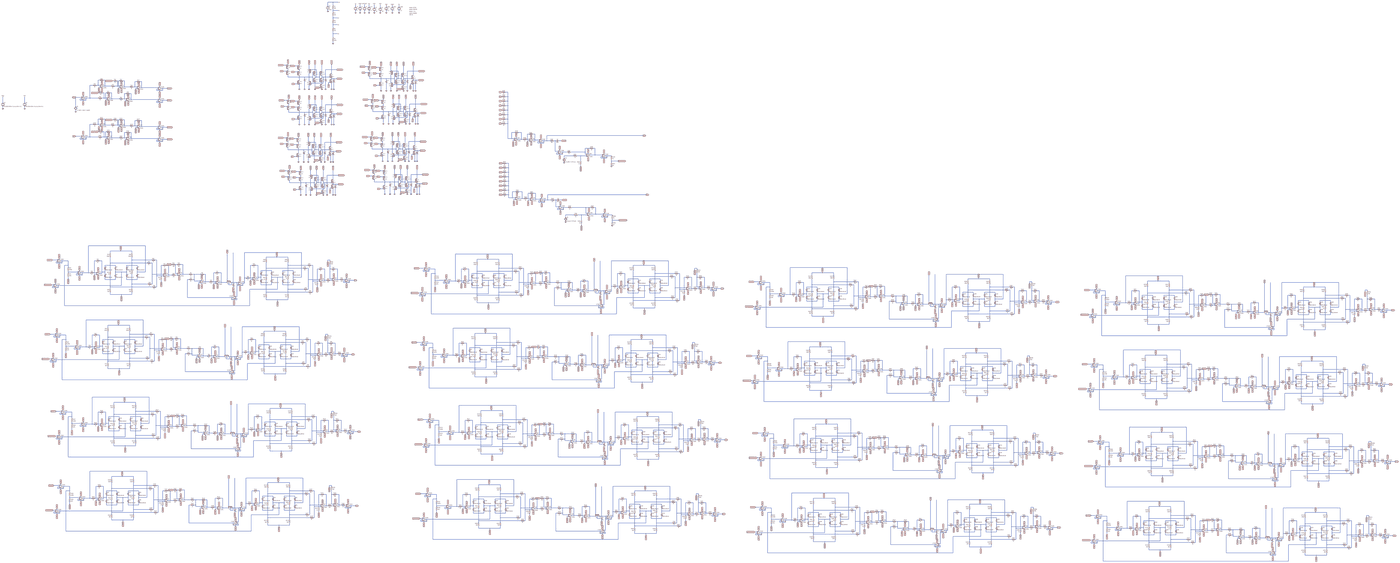
[diagram p0: schematic OZ_8_bounded_curves.asc, whole sheet]
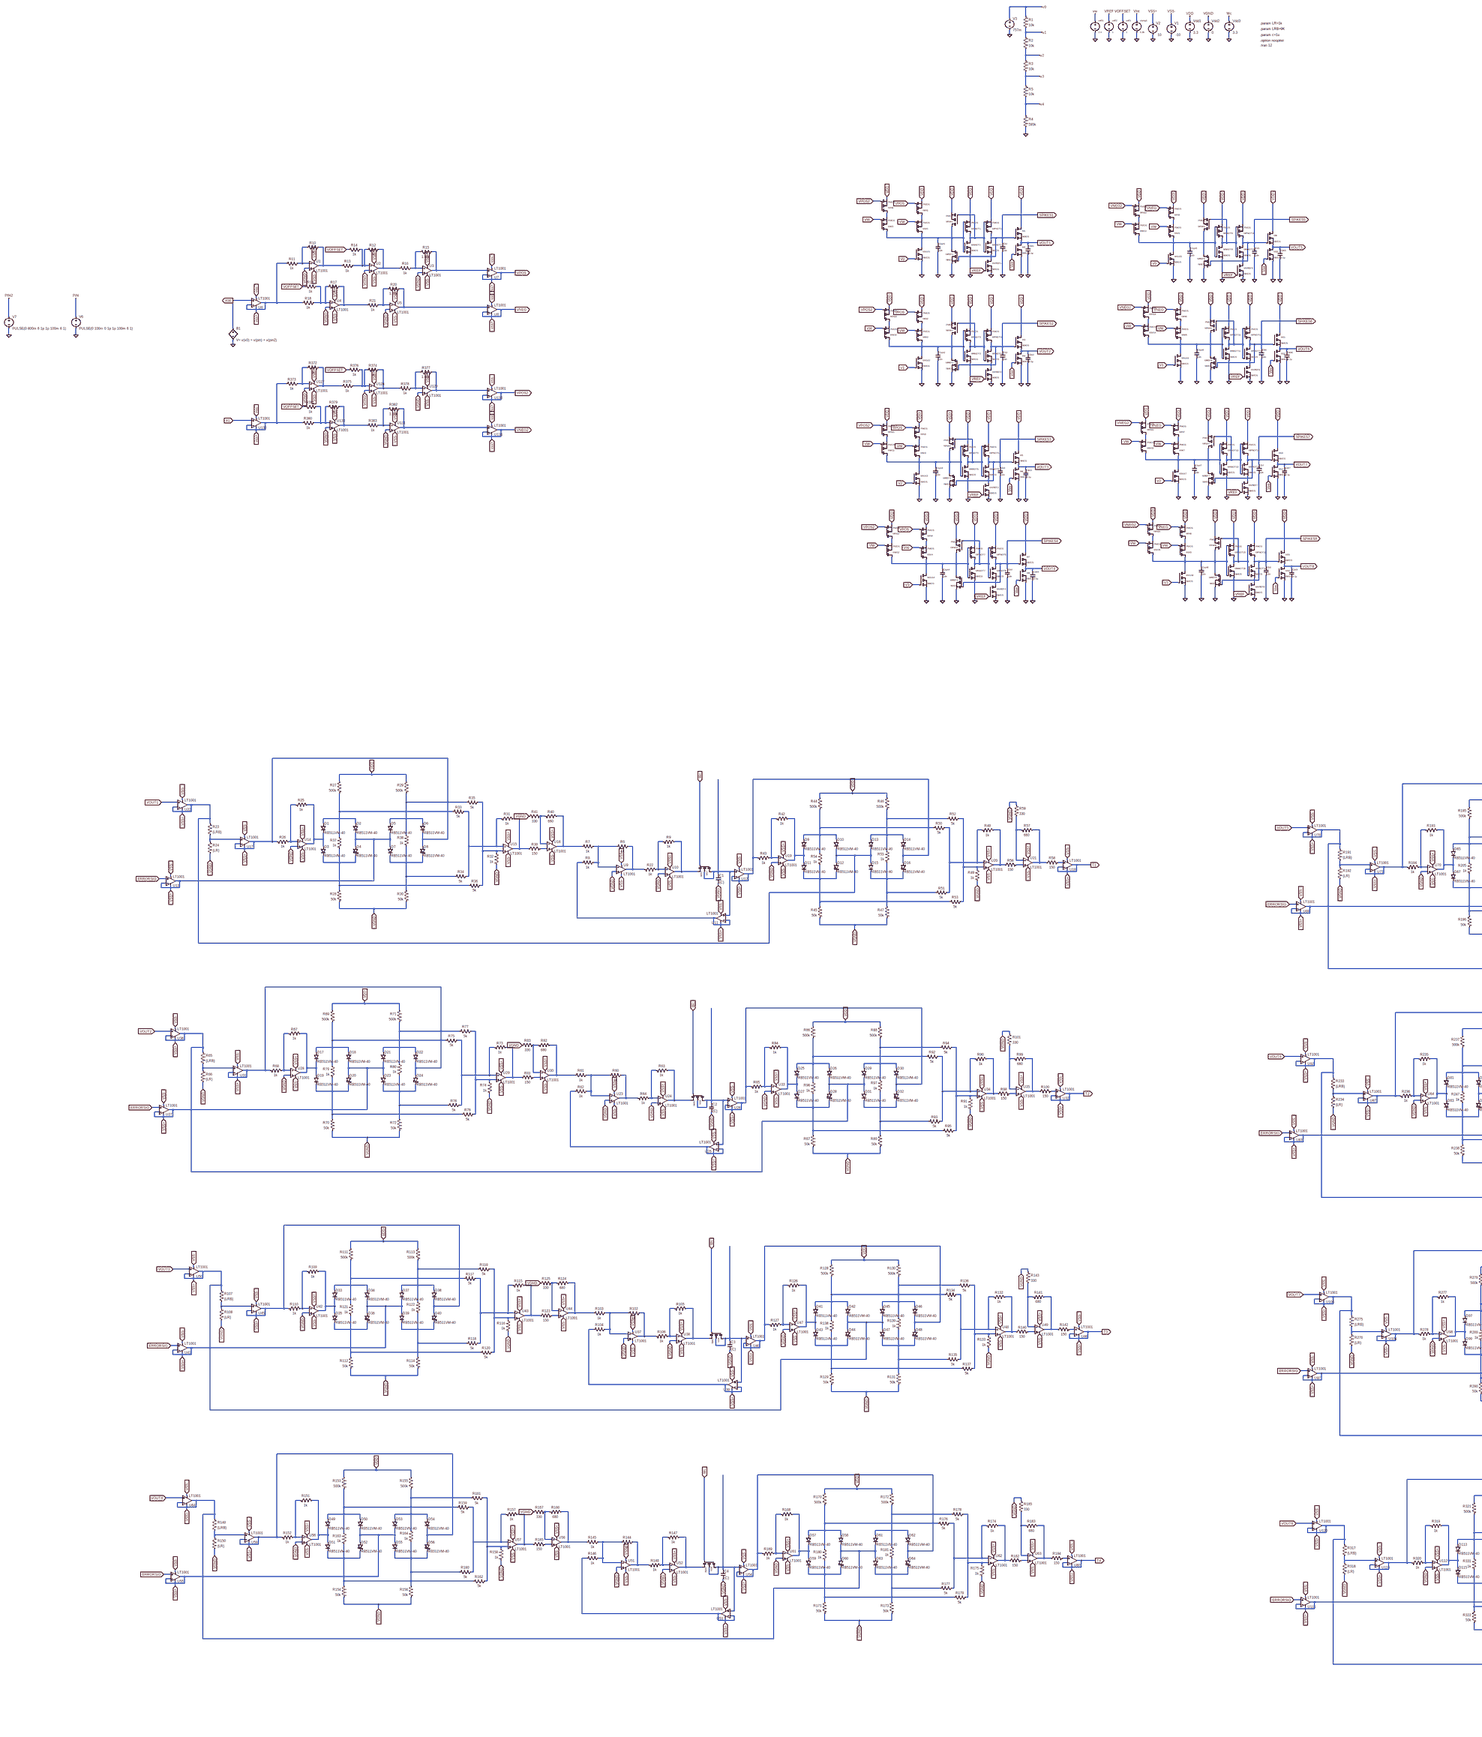
[diagram p1: schematic OZ_8_bounded_curves.asc, part, row 1 of 1, column 1 of 3]
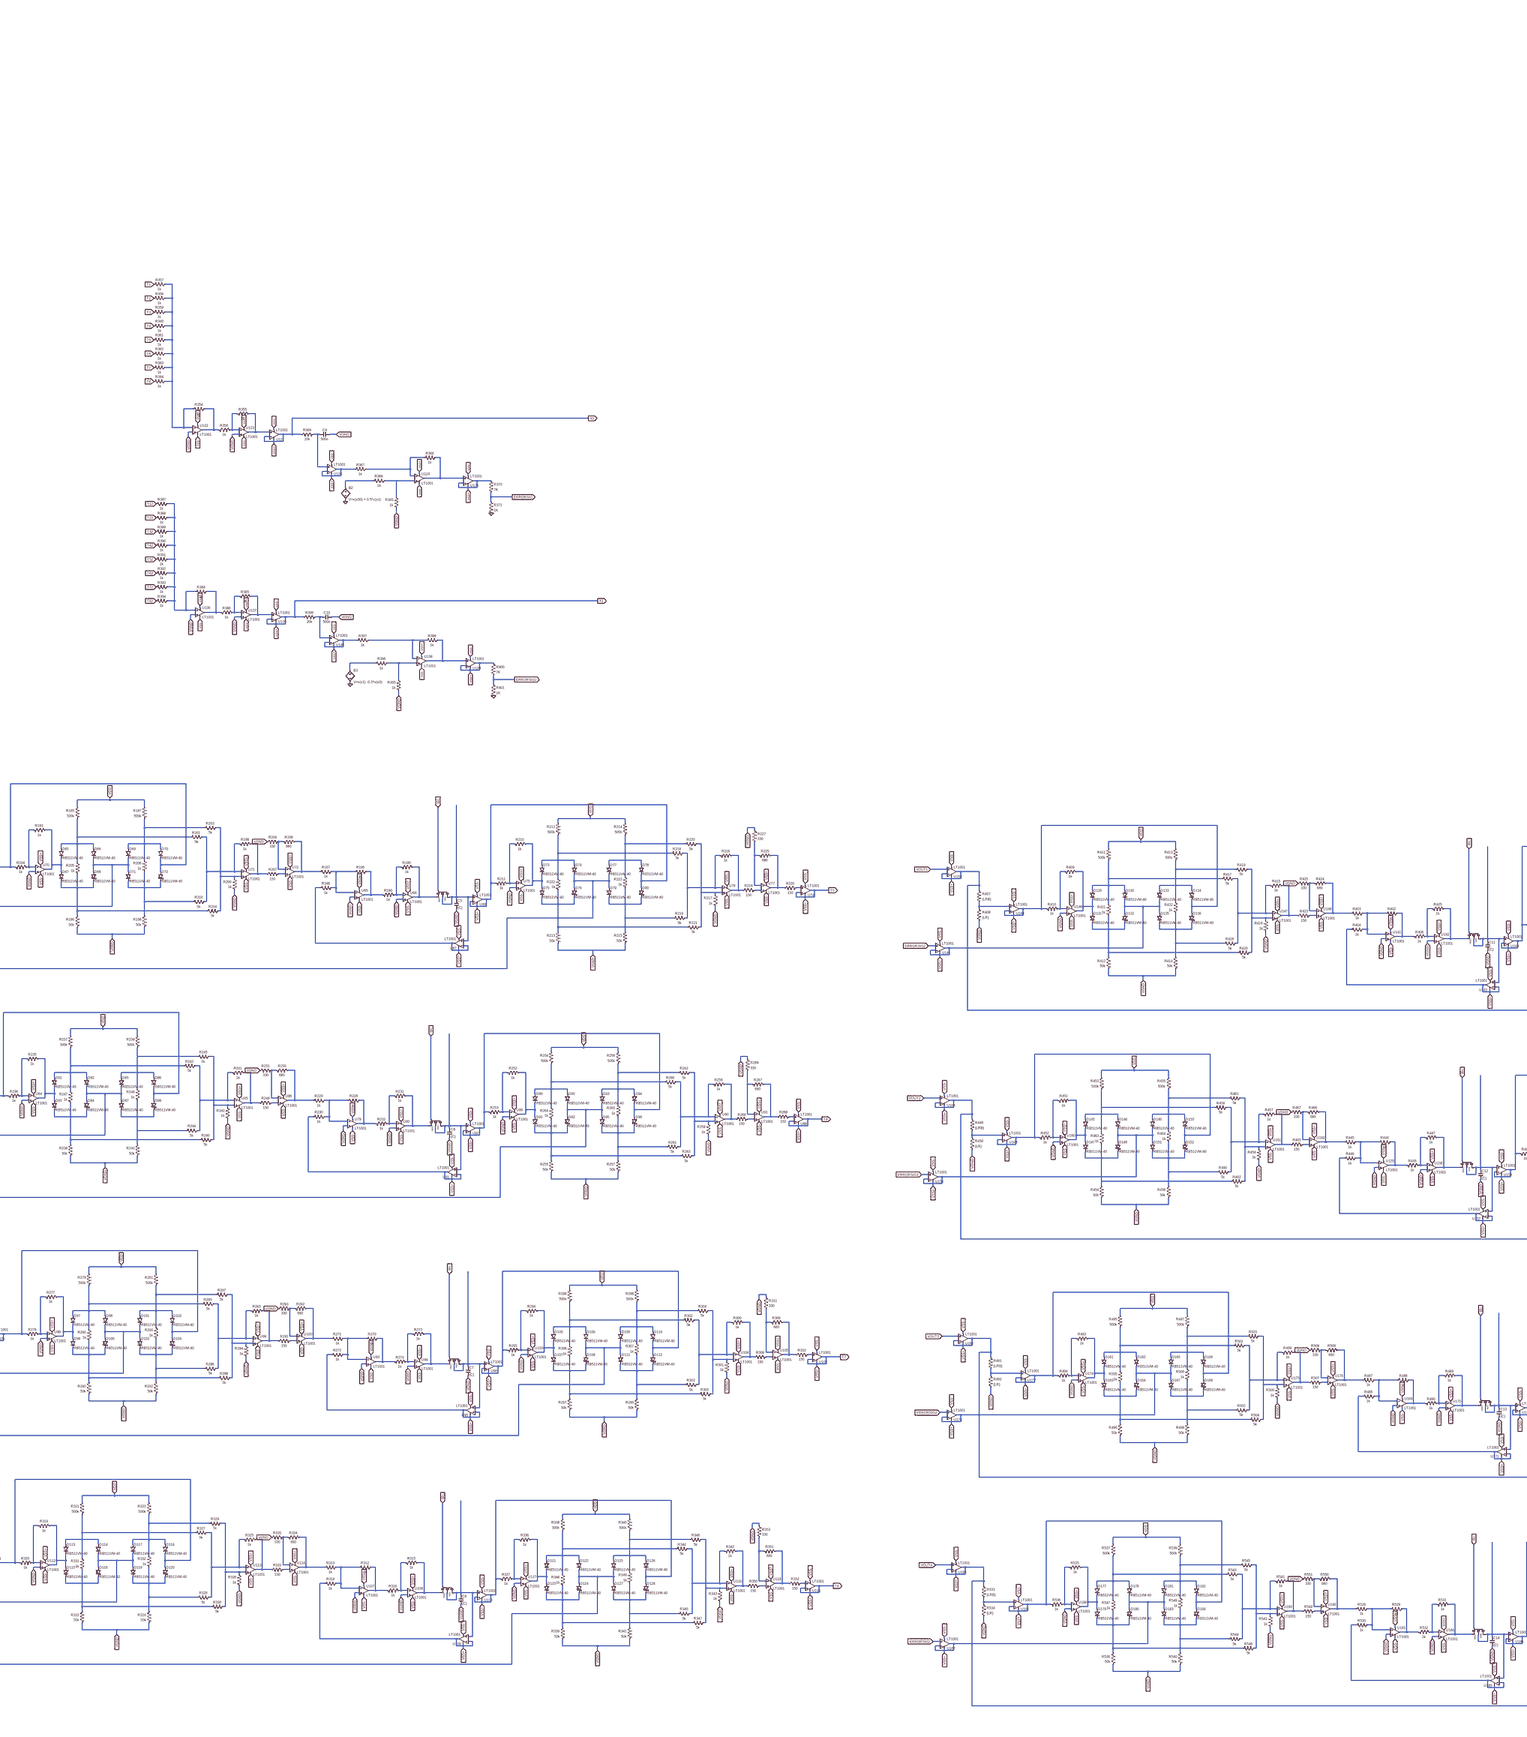
[diagram p2: schematic OZ_8_bounded_curves.asc, part, row 1 of 1, column 2 of 3]
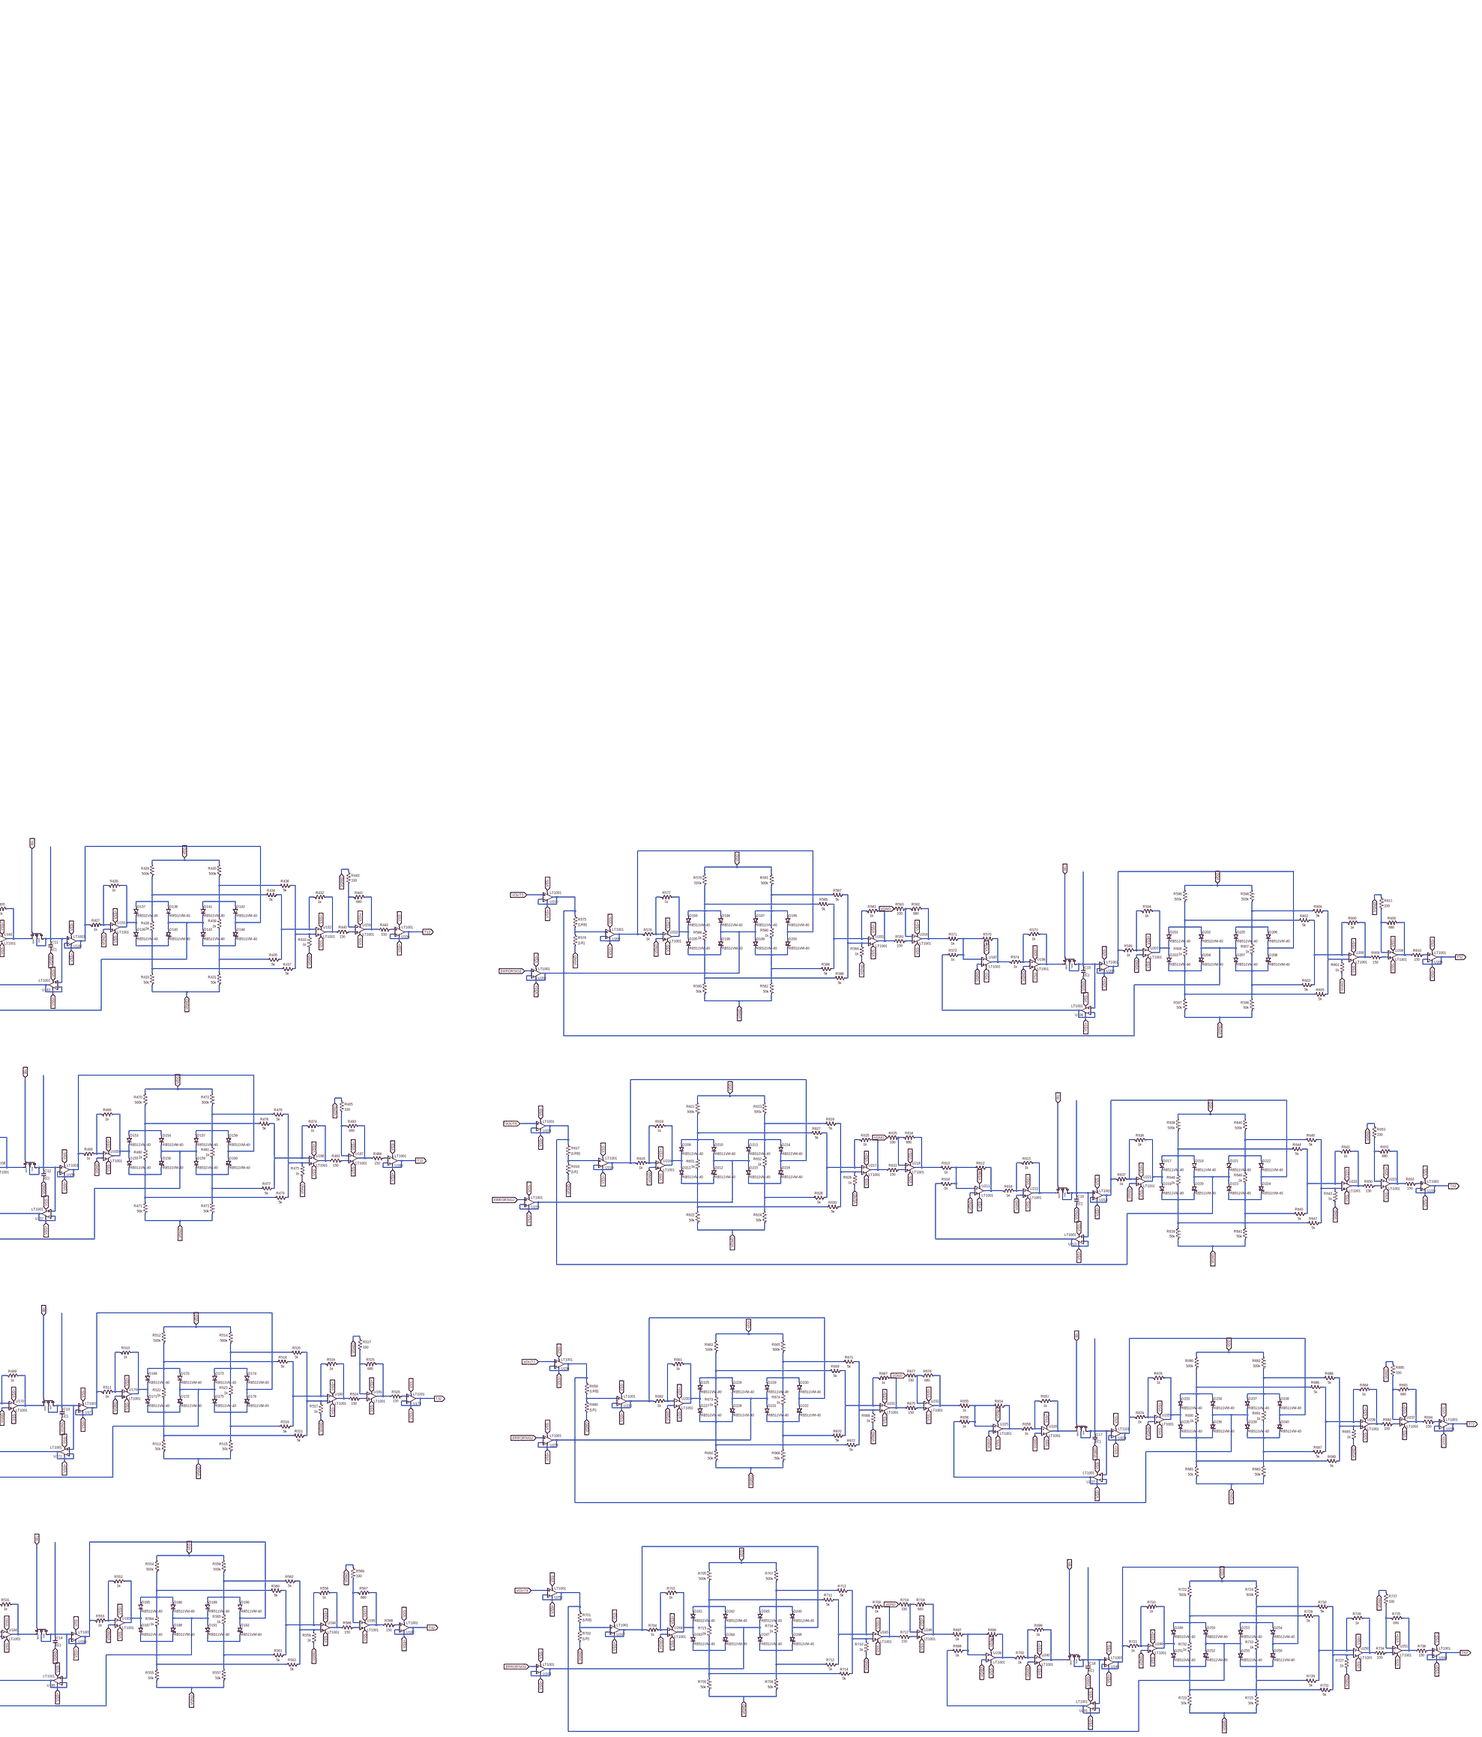
[diagram p3: schematic OZ_8_bounded_curves.asc, part, row 1 of 1, column 3 of 3]
* OZ_8_bounded_curves.asc
vtemp1 Vint 0 0.28
Vdd1 VDD 0 3.3
V1 VSS- 0 -10
V2 VSS+ 0 10
voff1 VOFFSET 0 1
voff2 VREF 0 1
voff3 vw 0 2.4
Vdd2 VGND 0 0
XU1 VGND N009 VSS+ VSS- N010 LT1001  ; pins In+ In- V+ V- OUT
R10 N010 N009 1k
R11 N009 N016 1k
XU2 VGND N011 VSS+ VSS- N012 LT1001  ; pins In+ In- V+ V- OUT
R12 N012 N011 1k
R13 N011 N010 1k
R14 N011 VOFFSET 1k
XU3 VGND N013 VSS+ VSS- N014 LT1001  ; pins In+ In- V+ V- OUT
R15 N014 N013 1.65k
R16 N013 N012 1k
XU4 VGND N019 VSS+ VSS- N020 LT1001  ; pins In+ In- V+ V- OUT
R17 N020 N019 1k
R18 N019 N016 1k
R19 N019 VOFFSET 1k
XU5 VGND N021 VSS+ VSS- N022 LT1001  ; pins In+ In- V+ V- OUT
R20 N022 N021 1.65k
R21 N021 N020 1k
XU6 X00 N016 VSS+ VSS- N016 LT1001  ; pins In+ In- V+ V- OUT
XU7 N014 VPOS VSS+ VSS- VPOS LT1001  ; pins In+ In- V+ V- OUT
XU8 N022 VNEG VSS+ VSS- VNEG LT1001  ; pins In+ In- V+ V- OUT
V3 v0 0 757m
R1 v0 v1 10k
R2 v1 v2 10k
R3 v2 v3 10k
R4 v4 0 595k
R5 v3 v4 10k
XU121 N046 X0 VSS+ VSS- X0 LT1001  ; pins In+ In- V+ V- OUT
XU122 VGND N018 VSS+ VSS- N044 LT1001  ; pins In+ In- V+ V- OUT
R354 N044 N018 1k
XU123 VGND N045 VSS+ VSS- N046 LT1001  ; pins In+ In- V+ V- OUT
R355 N045 N046 1k
R356 N044 N045 1k
R357 N018 T1 1k
R358 N018 T2 1k
R359 N018 T3 1k
R360 N018 T4 1k
R361 N018 T5 1k
R362 N018 T6 1k
R363 N018 T7 1k
R364 N018 T8 1k
M17 N148 Wc N119 N148 NMOS
C1 N148 VGND {C} IC=0
XU9 VGND N127 VSS+ VSS- N128 LT1001  ; pins In+ In- V+ V- OUT
R6 N128 N127 1k
R7 N127 N097 1k
R8 N127 N139 1k
XU10 VGND N118 VSS+ VSS- N119 LT1001  ; pins In+ In- V+ V- OUT
R9 N118 N119 1k
R22 N128 N118 1k
XU11 N148 N139 VSS+ VSS- N139 LT1001  ; pins In+ In- V+ V- OUT
XU12 N148 N086 VSS+ VSS- N086 LT1001  ; pins In+ In- V+ V- OUT
R23 N090 N116 {LRB}
R24 N116 VGND {LR}
XU13 ERRORSIG N117 VSS+ VSS- N117 LT1001  ; pins In+ In- V+ V- OUT
D1 N094 N092 RB511VM-40
XU14 VGND N091 VSS+ VSS- N092 LT1001  ; pins In+ In- V+ V- OUT
R25 N091 N092 1k
R26 N085 N091 1k
D2 N094 N117 RB511VM-40
D3 N092 N137 RB511VM-40
D4 N117 N137 RB511VM-40
R27 VDD N094 500k
R28 N137 VGND 50k
D5 N088 N117 RB511VM-40
D6 N088 N085 RB511VM-40
D7 N117 N138 RB511VM-40
D8 N085 N138 RB511VM-40
R29 VDD N088 500k
R30 N138 VGND 50k
XU15 N089 N095 VSS+ VSS- N098 LT1001  ; pins In+ In- V+ V- OUT
R31 N095 N098 1k
R32 VGND N089 1k
R33 N095 N094 5k
R34 N095 N138 5k
R35 N089 N088 5k
R36 N089 N137 5k
R37 N137 N094 1k
R38 N138 N088 1k
R39 N098 N130 150
XU16 N130 N096 VSS+ VSS- N097 LT1001  ; pins In+ In- V+ V- OUT
R40 N096 N097 680
R41 VGND N096 330
XU17 N116 N085 VSS+ VSS- N085 LT1001  ; pins In+ In- V+ V- OUT
XU18 N140 T1 VSS+ VSS- T1 LT1001  ; pins In+ In- V+ V- OUT
D9 N104 N100 RB511VM-40
XU19 VGND N099 VSS+ VSS- N100 LT1001  ; pins In+ In- V+ V- OUT
R42 N099 N100 1k
R43 N086 N099 1k
D10 N104 N090 RB511VM-40
D11 N100 N156 RB511VM-40
D12 N090 N156 RB511VM-40
R44 VDD N104 500k
R45 N156 VGND 50k
D13 N101 N090 RB511VM-40
D14 N101 N086 RB511VM-40
D15 N090 N157 RB511VM-40
D16 N086 N157 RB511VM-40
R46 VDD N101 500k
R47 N157 VGND 50k
XU20 N102 N105 VSS+ VSS- N108 LT1001  ; pins In+ In- V+ V- OUT
R48 N105 N108 1k
R49 VGND N102 1k
R50 N105 N104 5k
R51 N105 N157 5k
R52 N102 N101 5k
R53 N102 N156 5k
R54 N156 N104 1k
R55 N157 N101 1k
R56 N108 N141 150
XU21 N141 N109 VSS+ VSS- N110 LT1001  ; pins In+ In- V+ V- OUT
R57 N109 N110 680
R58 N110 N140 150
R59 VGND N109 330
XU22 VOUT1 N090 VSS+ VSS- N090 LT1001  ; pins In+ In- V+ V- OUT
M18 N292 Wc N263 N292 NMOS
C2 N292 VGND {C} IC=0
XU23 VGND N271 VSS+ VSS- N272 LT1001  ; pins In+ In- V+ V- OUT
R60 N272 N271 1k
R61 N271 N241 1k
R62 N271 N283 1k
XU24 VGND N262 VSS+ VSS- N263 LT1001  ; pins In+ In- V+ V- OUT
R63 N262 N263 1k
R64 N272 N262 1k
XU25 N292 N283 VSS+ VSS- N283 LT1001  ; pins In+ In- V+ V- OUT
XU26 N292 N230 VSS+ VSS- N230 LT1001  ; pins In+ In- V+ V- OUT
R65 N234 N260 {LRB}
R66 N260 VGND {LR}
XU27 ERRORSIG N261 VSS+ VSS- N261 LT1001  ; pins In+ In- V+ V- OUT
D17 N238 N236 RB511VM-40
XU28 VGND N235 VSS+ VSS- N236 LT1001  ; pins In+ In- V+ V- OUT
R67 N235 N236 1k
R68 N229 N235 1k
D18 N238 N261 RB511VM-40
D19 N236 N281 RB511VM-40
D20 N261 N281 RB511VM-40
R69 VDD N238 500k
R70 N281 VGND 50k
D21 N232 N261 RB511VM-40
D22 N232 N229 RB511VM-40
D23 N261 N282 RB511VM-40
D24 N229 N282 RB511VM-40
R71 VDD N232 500k
R72 N282 VGND 50k
XU29 N233 N239 VSS+ VSS- N242 LT1001  ; pins In+ In- V+ V- OUT
R73 N239 N242 1k
R74 VGND N233 1k
R75 N239 N238 5k
R76 N239 N282 5k
R77 N233 N232 5k
R78 N233 N281 5k
R79 N281 N238 1k
R80 N282 N232 1k
R81 N242 N274 150
XU30 N274 N240 VSS+ VSS- N241 LT1001  ; pins In+ In- V+ V- OUT
R82 N240 N241 680
R83 VGND N240 330
XU31 N260 N229 VSS+ VSS- N229 LT1001  ; pins In+ In- V+ V- OUT
XU32 N284 T2 VSS+ VSS- T2 LT1001  ; pins In+ In- V+ V- OUT
D25 N248 N244 RB511VM-40
XU33 VGND N243 VSS+ VSS- N244 LT1001  ; pins In+ In- V+ V- OUT
R84 N243 N244 1k
R85 N230 N243 1k
D26 N248 N234 RB511VM-40
D27 N244 N300 RB511VM-40
D28 N234 N300 RB511VM-40
R86 VDD N248 500k
R87 N300 VGND 50k
D29 N245 N234 RB511VM-40
D30 N245 N230 RB511VM-40
D31 N234 N301 RB511VM-40
D32 N230 N301 RB511VM-40
R88 VDD N245 500k
R89 N301 VGND 50k
XU34 N246 N249 VSS+ VSS- N252 LT1001  ; pins In+ In- V+ V- OUT
R90 N249 N252 1k
R91 VGND N246 1k
R92 N249 N248 5k
R93 N249 N301 5k
R94 N246 N245 5k
R95 N246 N300 5k
R96 N300 N248 1k
R97 N301 N245 1k
R98 N252 N285 150
XU35 N285 N253 VSS+ VSS- N254 LT1001  ; pins In+ In- V+ V- OUT
R99 N253 N254 680
R100 N254 N284 150
R101 VGND N253 330
XU36 VOUT2 N234 VSS+ VSS- N234 LT1001  ; pins In+ In- V+ V- OUT
M19 N436 Wc N407 N436 NMOS
C3 N436 VGND {C} IC=0
XU37 VGND N415 VSS+ VSS- N416 LT1001  ; pins In+ In- V+ V- OUT
R102 N416 N415 1k
R103 N415 N385 1k
R104 N415 N427 1k
XU38 VGND N406 VSS+ VSS- N407 LT1001  ; pins In+ In- V+ V- OUT
R105 N406 N407 1k
R106 N416 N406 1k
XU39 N436 N427 VSS+ VSS- N427 LT1001  ; pins In+ In- V+ V- OUT
XU40 N436 N374 VSS+ VSS- N374 LT1001  ; pins In+ In- V+ V- OUT
R107 N378 N404 {LRB}
R108 N404 VGND {LR}
XU41 ERRORSIG N405 VSS+ VSS- N405 LT1001  ; pins In+ In- V+ V- OUT
D33 N382 N380 RB511VM-40
XU42 VGND N379 VSS+ VSS- N380 LT1001  ; pins In+ In- V+ V- OUT
R109 N379 N380 1k
R110 N373 N379 1k
D34 N382 N405 RB511VM-40
D35 N380 N425 RB511VM-40
D36 N405 N425 RB511VM-40
R111 VDD N382 500k
R112 N425 VGND 50k
D37 N376 N405 RB511VM-40
D38 N376 N373 RB511VM-40
D39 N405 N426 RB511VM-40
D40 N373 N426 RB511VM-40
R113 VDD N376 500k
R114 N426 VGND 50k
XU43 N377 N383 VSS+ VSS- N386 LT1001  ; pins In+ In- V+ V- OUT
R115 N383 N386 1k
R116 VGND N377 1k
R117 N383 N382 5k
R118 N383 N426 5k
R119 N377 N376 5k
R120 N377 N425 5k
R121 N425 N382 1k
R122 N426 N376 1k
R123 N386 N418 150
XU44 N418 N384 VSS+ VSS- N385 LT1001  ; pins In+ In- V+ V- OUT
R124 N384 N385 680
R125 VGND N384 330
XU45 N404 N373 VSS+ VSS- N373 LT1001  ; pins In+ In- V+ V- OUT
XU46 N428 T3 VSS+ VSS- T3 LT1001  ; pins In+ In- V+ V- OUT
D41 N392 N388 RB511VM-40
XU47 VGND N387 VSS+ VSS- N388 LT1001  ; pins In+ In- V+ V- OUT
R126 N387 N388 1k
R127 N374 N387 1k
D42 N392 N378 RB511VM-40
D43 N388 N444 RB511VM-40
D44 N378 N444 RB511VM-40
R128 VDD N392 500k
R129 N444 VGND 50k
D45 N389 N378 RB511VM-40
D46 N389 N374 RB511VM-40
D47 N378 N445 RB511VM-40
D48 N374 N445 RB511VM-40
R130 VDD N389 500k
R131 N445 VGND 50k
XU48 N390 N393 VSS+ VSS- N396 LT1001  ; pins In+ In- V+ V- OUT
R132 N393 N396 1k
R133 VGND N390 1k
R134 N393 N392 5k
R135 N393 N445 5k
R136 N390 N389 5k
R137 N390 N444 5k
R138 N444 N392 1k
R139 N445 N389 1k
R140 N396 N429 150
XU49 N429 N397 VSS+ VSS- N398 LT1001  ; pins In+ In- V+ V- OUT
R141 N397 N398 680
R142 N398 N428 150
R143 VGND N397 330
XU50 VOUT3 N378 VSS+ VSS- N378 LT1001  ; pins In+ In- V+ V- OUT
M20 N580 Wc N551 N580 NMOS
C4 N580 VGND {C} IC=0
XU51 VGND N559 VSS+ VSS- N560 LT1001  ; pins In+ In- V+ V- OUT
R144 N560 N559 1k
R145 N559 N529 1k
R146 N559 N571 1k
XU52 VGND N550 VSS+ VSS- N551 LT1001  ; pins In+ In- V+ V- OUT
R147 N550 N551 1k
R148 N560 N550 1k
XU53 N580 N571 VSS+ VSS- N571 LT1001  ; pins In+ In- V+ V- OUT
XU54 N580 N518 VSS+ VSS- N518 LT1001  ; pins In+ In- V+ V- OUT
R149 N522 N548 {LRB}
R150 N548 VGND {LR}
XU55 ERRORSIG N549 VSS+ VSS- N549 LT1001  ; pins In+ In- V+ V- OUT
D49 N526 N524 RB511VM-40
XU56 VGND N523 VSS+ VSS- N524 LT1001  ; pins In+ In- V+ V- OUT
R151 N523 N524 1k
R152 N517 N523 1k
D50 N526 N549 RB511VM-40
D51 N524 N569 RB511VM-40
D52 N549 N569 RB511VM-40
R153 VDD N526 500k
R154 N569 VGND 50k
D53 N520 N549 RB511VM-40
D54 N520 N517 RB511VM-40
D55 N549 N570 RB511VM-40
D56 N517 N570 RB511VM-40
R155 VDD N520 500k
R156 N570 VGND 50k
XU57 N521 N527 VSS+ VSS- N530 LT1001  ; pins In+ In- V+ V- OUT
R157 N527 N530 1k
R158 VGND N521 1k
R159 N527 N526 5k
R160 N527 N570 5k
R161 N521 N520 5k
R162 N521 N569 5k
R163 N569 N526 1k
R164 N570 N520 1k
R165 N530 N562 150
XU58 N562 N528 VSS+ VSS- N529 LT1001  ; pins In+ In- V+ V- OUT
R166 N528 N529 680
R167 VGND N528 330
XU59 N548 N517 VSS+ VSS- N517 LT1001  ; pins In+ In- V+ V- OUT
XU60 N572 T4 VSS+ VSS- T4 LT1001  ; pins In+ In- V+ V- OUT
D57 N536 N532 RB511VM-40
XU61 VGND N531 VSS+ VSS- N532 LT1001  ; pins In+ In- V+ V- OUT
R168 N531 N532 1k
R169 N518 N531 1k
D58 N536 N522 RB511VM-40
D59 N532 N588 RB511VM-40
D60 N522 N588 RB511VM-40
R170 VDD N536 500k
R171 N588 VGND 50k
D61 N533 N522 RB511VM-40
D62 N533 N518 RB511VM-40
D63 N522 N589 RB511VM-40
D64 N518 N589 RB511VM-40
R172 VDD N533 500k
R173 N589 VGND 50k
XU62 N534 N537 VSS+ VSS- N540 LT1001  ; pins In+ In- V+ V- OUT
R174 N537 N540 1k
R175 VGND N534 1k
R176 N537 N536 5k
R177 N537 N589 5k
R178 N534 N533 5k
R179 N534 N588 5k
R180 N588 N536 1k
R181 N589 N533 1k
R182 N540 N573 150
XU63 N573 N541 VSS+ VSS- N542 LT1001  ; pins In+ In- V+ V- OUT
R183 N541 N542 680
R184 N542 N572 150
R185 VGND N541 330
XU64 VOUT4 N522 VSS+ VSS- N522 LT1001  ; pins In+ In- V+ V- OUT
M21 N176 Wc N145 N176 NMOS
C5 N176 VGND {C} IC=0
XU65 VGND N149 VSS+ VSS- N150 LT1001  ; pins In+ In- V+ V- OUT
R186 N150 N149 1k
R187 N149 N121 1k
R188 N149 N169 1k
XU66 VGND N144 VSS+ VSS- N145 LT1001  ; pins In+ In- V+ V- OUT
R189 N144 N145 1k
R190 N150 N144 1k
XU67 N176 N169 VSS+ VSS- N169 LT1001  ; pins In+ In- V+ V- OUT
XU68 N176 N093 VSS+ VSS- N093 LT1001  ; pins In+ In- V+ V- OUT
R191 N111 N142 {LRB}
R192 N142 VGND {LR}
XU69 ERRORSIG N143 VSS+ VSS- N143 LT1001  ; pins In+ In- V+ V- OUT
D65 N114 N113 RB511VM-40
XU70 VGND N112 VSS+ VSS- N113 LT1001  ; pins In+ In- V+ V- OUT
R193 N112 N113 1k
R194 N087 N112 1k
D66 N114 N143 RB511VM-40
D67 N113 N167 RB511VM-40
D68 N143 N167 RB511VM-40
R195 VDD N114 500k
R196 N167 VGND 50k
D69 N106 N143 RB511VM-40
D70 N106 N087 RB511VM-40
D71 N143 N168 RB511VM-40
D72 N087 N168 RB511VM-40
R197 VDD N106 500k
R198 N168 VGND 50k
XU71 N107 N115 VSS+ VSS- N122 LT1001  ; pins In+ In- V+ V- OUT
R199 N115 N122 1k
R200 VGND N107 1k
R201 N115 N114 5k
R202 N115 N168 5k
R203 N107 N106 5k
R204 N107 N167 5k
R205 N167 N114 1k
R206 N168 N106 1k
R207 N122 N155 150
XU72 N155 N120 VSS+ VSS- N121 LT1001  ; pins In+ In- V+ V- OUT
R208 N120 N121 680
R209 VGND N120 330
XU73 N142 N087 VSS+ VSS- N087 LT1001  ; pins In+ In- V+ V- OUT
XU74 N170 T5 VSS+ VSS- T5 LT1001  ; pins In+ In- V+ V- OUT
D73 N132 N124 RB511VM-40
XU75 VGND N123 VSS+ VSS- N124 LT1001  ; pins In+ In- V+ V- OUT
R210 N123 N124 1k
R211 N093 N123 1k
D74 N132 N111 RB511VM-40
D75 N124 N183 RB511VM-40
D76 N111 N183 RB511VM-40
R212 VDD N132 500k
R213 N183 VGND 50k
D77 N125 N111 RB511VM-40
D78 N125 N093 RB511VM-40
D79 N111 N184 RB511VM-40
D80 N093 N184 RB511VM-40
R214 VDD N125 500k
R215 N184 VGND 50k
XU76 N126 N133 VSS+ VSS- N134 LT1001  ; pins In+ In- V+ V- OUT
R216 N133 N134 1k
R217 VGND N126 1k
R218 N133 N132 5k
R219 N133 N184 5k
R220 N126 N125 5k
R221 N126 N183 5k
R222 N183 N132 1k
R223 N184 N125 1k
R224 N134 N171 150
XU77 N171 N135 VSS+ VSS- N136 LT1001  ; pins In+ In- V+ V- OUT
R225 N135 N136 680
R226 N136 N170 150
R227 VGND N135 330
XU78 VOUT5 N111 VSS+ VSS- N111 LT1001  ; pins In+ In- V+ V- OUT
M22 N320 Wc N289 N320 NMOS
C6 N320 VGND {C} IC=0
XU79 VGND N293 VSS+ VSS- N294 LT1001  ; pins In+ In- V+ V- OUT
R228 N294 N293 1k
R229 N293 N265 1k
R230 N293 N313 1k
XU80 VGND N288 VSS+ VSS- N289 LT1001  ; pins In+ In- V+ V- OUT
R231 N288 N289 1k
R232 N294 N288 1k
XU81 N320 N313 VSS+ VSS- N313 LT1001  ; pins In+ In- V+ V- OUT
XU82 N320 N237 VSS+ VSS- N237 LT1001  ; pins In+ In- V+ V- OUT
R233 N255 N286 {LRB}
R234 N286 VGND {LR}
XU83 ERRORSIG N287 VSS+ VSS- N287 LT1001  ; pins In+ In- V+ V- OUT
D81 N258 N257 RB511VM-40
XU84 VGND N256 VSS+ VSS- N257 LT1001  ; pins In+ In- V+ V- OUT
R235 N256 N257 1k
R236 N231 N256 1k
D82 N258 N287 RB511VM-40
D83 N257 N311 RB511VM-40
D84 N287 N311 RB511VM-40
R237 VDD N258 500k
R238 N311 VGND 50k
D85 N250 N287 RB511VM-40
D86 N250 N231 RB511VM-40
D87 N287 N312 RB511VM-40
D88 N231 N312 RB511VM-40
R239 VDD N250 500k
R240 N312 VGND 50k
XU85 N251 N259 VSS+ VSS- N266 LT1001  ; pins In+ In- V+ V- OUT
R241 N259 N266 1k
R242 VGND N251 1k
R243 N259 N258 5k
R244 N259 N312 5k
R245 N251 N250 5k
R246 N251 N311 5k
R247 N311 N258 1k
R248 N312 N250 1k
R249 N266 N299 150
XU86 N299 N264 VSS+ VSS- N265 LT1001  ; pins In+ In- V+ V- OUT
R250 N264 N265 680
R251 VGND N264 330
XU87 N286 N231 VSS+ VSS- N231 LT1001  ; pins In+ In- V+ V- OUT
XU88 N314 T6 VSS+ VSS- T6 LT1001  ; pins In+ In- V+ V- OUT
D89 N276 N268 RB511VM-40
XU89 VGND N267 VSS+ VSS- N268 LT1001  ; pins In+ In- V+ V- OUT
R252 N267 N268 1k
R253 N237 N267 1k
D90 N276 N255 RB511VM-40
D91 N268 N327 RB511VM-40
D92 N255 N327 RB511VM-40
R254 VDD N276 500k
R255 N327 VGND 50k
D93 N269 N255 RB511VM-40
D94 N269 N237 RB511VM-40
D95 N255 N328 RB511VM-40
D96 N237 N328 RB511VM-40
R256 VDD N269 500k
R257 N328 VGND 50k
XU90 N270 N277 VSS+ VSS- N278 LT1001  ; pins In+ In- V+ V- OUT
R258 N277 N278 1k
R259 VGND N270 1k
R260 N277 N276 5k
R261 N277 N328 5k
R262 N270 N269 5k
R263 N270 N327 5k
R264 N327 N276 1k
R265 N328 N269 1k
R266 N278 N315 150
XU91 N315 N279 VSS+ VSS- N280 LT1001  ; pins In+ In- V+ V- OUT
R267 N279 N280 680
R268 N280 N314 150
R269 VGND N279 330
XU92 VOUT6 N255 VSS+ VSS- N255 LT1001  ; pins In+ In- V+ V- OUT
M23 N464 Wc N433 N464 NMOS
C7 N464 VGND {C} IC=0
XU93 VGND N437 VSS+ VSS- N438 LT1001  ; pins In+ In- V+ V- OUT
R270 N438 N437 1k
R271 N437 N409 1k
R272 N437 N457 1k
XU94 VGND N432 VSS+ VSS- N433 LT1001  ; pins In+ In- V+ V- OUT
R273 N432 N433 1k
R274 N438 N432 1k
XU95 N464 N457 VSS+ VSS- N457 LT1001  ; pins In+ In- V+ V- OUT
XU96 N464 N381 VSS+ VSS- N381 LT1001  ; pins In+ In- V+ V- OUT
R275 N399 N430 {LRB}
R276 N430 VGND {LR}
XU97 ERRORSIG N431 VSS+ VSS- N431 LT1001  ; pins In+ In- V+ V- OUT
D97 N402 N401 RB511VM-40
XU98 VGND N400 VSS+ VSS- N401 LT1001  ; pins In+ In- V+ V- OUT
R277 N400 N401 1k
R278 N375 N400 1k
D98 N402 N431 RB511VM-40
D99 N401 N455 RB511VM-40
D100 N431 N455 RB511VM-40
R279 VDD N402 500k
R280 N455 VGND 50k
D101 N394 N431 RB511VM-40
D102 N394 N375 RB511VM-40
D103 N431 N456 RB511VM-40
D104 N375 N456 RB511VM-40
R281 VDD N394 500k
R282 N456 VGND 50k
XU99 N395 N403 VSS+ VSS- N410 LT1001  ; pins In+ In- V+ V- OUT
R283 N403 N410 1k
R284 VGND N395 1k
R285 N403 N402 5k
R286 N403 N456 5k
R287 N395 N394 5k
R288 N395 N455 5k
R289 N455 N402 1k
R290 N456 N394 1k
R291 N410 N443 150
XU100 N443 N408 VSS+ VSS- N409 LT1001  ; pins In+ In- V+ V- OUT
R292 N408 N409 680
R293 VGND N408 330
XU101 N430 N375 VSS+ VSS- N375 LT1001  ; pins In+ In- V+ V- OUT
XU102 N458 T7 VSS+ VSS- T7 LT1001  ; pins In+ In- V+ V- OUT
D105 N420 N412 RB511VM-40
XU103 VGND N411 VSS+ VSS- N412 LT1001  ; pins In+ In- V+ V- OUT
R294 N411 N412 1k
R295 N381 N411 1k
D106 N420 N399 RB511VM-40
D107 N412 N471 RB511VM-40
D108 N399 N471 RB511VM-40
R296 VDD N420 500k
R297 N471 VGND 50k
D109 N413 N399 RB511VM-40
D110 N413 N381 RB511VM-40
D111 N399 N472 RB511VM-40
D112 N381 N472 RB511VM-40
R298 VDD N413 500k
R299 N472 VGND 50k
XU104 N414 N421 VSS+ VSS- N422 LT1001  ; pins In+ In- V+ V- OUT
R300 N421 N422 1k
R301 VGND N414 1k
R302 N421 N420 5k
R303 N421 N472 5k
R304 N414 N413 5k
R305 N414 N471 5k
R306 N471 N420 1k
R307 N472 N413 1k
R308 N422 N459 150
XU105 N459 N423 VSS+ VSS- N424 LT1001  ; pins In+ In- V+ V- OUT
R309 N423 N424 680
R310 N424 N458 150
R311 VGND N423 330
XU106 VOUT7 N399 VSS+ VSS- N399 LT1001  ; pins In+ In- V+ V- OUT
M24 N608 Wc N577 N608 NMOS
C8 N608 VGND {C} IC=0
XU107 VGND N581 VSS+ VSS- N582 LT1001  ; pins In+ In- V+ V- OUT
R312 N582 N581 1k
R313 N581 N553 1k
R314 N581 N601 1k
XU108 VGND N576 VSS+ VSS- N577 LT1001  ; pins In+ In- V+ V- OUT
R315 N576 N577 1k
R316 N582 N576 1k
XU109 N608 N601 VSS+ VSS- N601 LT1001  ; pins In+ In- V+ V- OUT
XU110 N608 N525 VSS+ VSS- N525 LT1001  ; pins In+ In- V+ V- OUT
R317 N543 N574 {LRB}
R318 N574 VGND {LR}
XU111 ERRORSIG N575 VSS+ VSS- N575 LT1001  ; pins In+ In- V+ V- OUT
D113 N546 N545 RB511VM-40
XU112 VGND N544 VSS+ VSS- N545 LT1001  ; pins In+ In- V+ V- OUT
R319 N544 N545 1k
R320 N519 N544 1k
D114 N546 N575 RB511VM-40
D115 N545 N599 RB511VM-40
D116 N575 N599 RB511VM-40
R321 VDD N546 500k
R322 N599 VGND 50k
D117 N538 N575 RB511VM-40
D118 N538 N519 RB511VM-40
D119 N575 N600 RB511VM-40
D120 N519 N600 RB511VM-40
R323 VDD N538 500k
R324 N600 VGND 50k
XU113 N539 N547 VSS+ VSS- N554 LT1001  ; pins In+ In- V+ V- OUT
R325 N547 N554 1k
R326 VGND N539 1k
R327 N547 N546 5k
R328 N547 N600 5k
R329 N539 N538 5k
R330 N539 N599 5k
R331 N599 N546 1k
R332 N600 N538 1k
R333 N554 N587 150
XU114 N587 N552 VSS+ VSS- N553 LT1001  ; pins In+ In- V+ V- OUT
R334 N552 N553 680
R335 VGND N552 330
XU115 N574 N519 VSS+ VSS- N519 LT1001  ; pins In+ In- V+ V- OUT
XU116 N602 T8 VSS+ VSS- T8 LT1001  ; pins In+ In- V+ V- OUT
D121 N564 N556 RB511VM-40
XU117 VGND N555 VSS+ VSS- N556 LT1001  ; pins In+ In- V+ V- OUT
R336 N555 N556 1k
R337 N525 N555 1k
D122 N564 N543 RB511VM-40
D123 N556 N615 RB511VM-40
D124 N543 N615 RB511VM-40
R338 VDD N564 500k
R339 N615 VGND 50k
D125 N557 N543 RB511VM-40
D126 N557 N525 RB511VM-40
D127 N543 N616 RB511VM-40
D128 N525 N616 RB511VM-40
R340 VDD N557 500k
R341 N616 VGND 50k
XU118 N558 N565 VSS+ VSS- N566 LT1001  ; pins In+ In- V+ V- OUT
R342 N565 N566 1k
R343 VGND N558 1k
R344 N565 N564 5k
R345 N565 N616 5k
R346 N558 N557 5k
R347 N558 N615 5k
R348 N615 N564 1k
R349 N616 N557 1k
R350 N566 N603 150
XU119 N603 N567 VSS+ VSS- N568 LT1001  ; pins In+ In- V+ V- OUT
R351 N567 N568 680
R352 N568 N602 150
R353 VGND N567 330
XU120 VOUT8 N543 VSS+ VSS- N543 LT1001  ; pins In+ In- V+ V- OUT
XU124 N061 N054 VSS+ VSS- N055 LT1001  ; pins In+ In- V+ V- OUT
R365 VGND N061 1k
R366 N061 N060 1k
R367 N054 N058 1k
R368 N055 N054 1k
XU125 N055 N062 VSS+ VSS- N062 LT1001  ; pins In+ In- V+ V- OUT
R369 X0 N047 20k
C9 N047 VGND 500n
XU126 N047 N058 VSS+ VSS- N058 LT1001  ; pins In+ In- V+ V- OUT
R370 N062 ERRORSIG 7K
R371 ERRORSIG 0 1K
Vdd3 Wc 0 3.3
XU127 VGND N032 VSS+ VSS- N033 LT1001  ; pins In+ In- V+ V- OUT
R372 N033 N032 1k
R373 N032 N039 1k
XU128 VGND N035 VSS+ VSS- N036 LT1001  ; pins In+ In- V+ V- OUT
R374 N036 N035 1k
R375 N035 N033 1k
R376 N035 VOFFSET 1k
XU129 VGND N037 VSS+ VSS- N038 LT1001  ; pins In+ In- V+ V- OUT
R377 N038 N037 1.65k
R378 N037 N036 1k
XU130 VGND N040 VSS+ VSS- N041 LT1001  ; pins In+ In- V+ V- OUT
R379 N041 N040 1k
R380 N040 N039 1k
R381 N040 VOFFSET 1k
XU131 VGND N042 VSS+ VSS- N043 LT1001  ; pins In+ In- V+ V- OUT
R382 N043 N042 1.65k
R383 N042 N041 1k
XU132 X1 N039 VSS+ VSS- N039 LT1001  ; pins In+ In- V+ V- OUT
XU133 N038 VPOS2 VSS+ VSS- VPOS2 LT1001  ; pins In+ In- V+ V- OUT
XU134 N043 VNEG2 VSS+ VSS- VNEG2 LT1001  ; pins In+ In- V+ V- OUT
MW1 N007 vw N003 N003 PMOS
Csyn1 N007 0 10n V=4 Irms=162m Rser=0.395426 Lser=0 mfg="KEMET" pn="C0402C103K7PAC" type="X5R" IC=0
Ck1 SPIKES1 0 10n
MPNOT1 N001 N007 VDD VDD PMOS
MNNOT1 N001 N007 0 0 NMOS
MVREF1 N015 VREF 0 0 NMOS
MREF1 N007 SPIKES1 0 0 NMOS
MVLK1 N007 v0 0 0 NMOS
MINA1 N007 N001 VDD VDD PMOS
MIN1 N003 VPOS VDD VDD PMOS
MPNOT2 SPIKES1 N001 VDD VDD PMOS
MNNOT2 SPIKES1 N001 N015 N015 NMOS
M1 VDD SPIKES1 VOUT1 VOUT1 NMOS
M2 VOUT1 Vint 0 0 NMOS
Cint1 VOUT1 0 0.1µ
MW2 N030 vw N028 N028 PMOS
Csyn2 N030 0 10n V=4 Irms=162m Rser=0.395426 Lser=0 mfg="KEMET" pn="C0402C103K7PAC" type="X5R" IC=0
Ck2 SPIKES2 0 10n
MPNOT3 N024 N030 VDD VDD PMOS
MNNOT3 N024 N030 0 0 NMOS
MVREF2 N034 VREF 0 0 NMOS
MREF2 N030 SPIKES2 0 0 NMOS
MVLK2 N030 v1 0 0 NMOS
MINA2 N030 N024 VDD VDD PMOS
MIN2 N028 VPOS VDD VDD PMOS
MPNOT4 SPIKES2 N024 VDD VDD PMOS
MNNOT4 SPIKES2 N024 N034 N034 NMOS
M3 VDD SPIKES2 VOUT2 VOUT2 NMOS
M4 VOUT2 Vint 0 0 NMOS
Cint2 VOUT2 0 0.1µ
MW3 N057 vw N053 N053 PMOS
Csyn3 N057 0 10n V=4 Irms=162m Rser=0.395426 Lser=0 mfg="KEMET" pn="C0402C103K7PAC" type="X5R" IC=0
Ck3 SPIKES3 0 10n
MPNOT5 N049 N057 VDD VDD PMOS
MNNOT5 N049 N057 0 0 NMOS
MVREF3 N063 VREF 0 0 NMOS
MREF3 N057 SPIKES3 0 0 NMOS
MVLK3 N057 v2 0 0 NMOS
MINA3 N057 N049 VDD VDD PMOS
MIN3 N053 VPOS VDD VDD PMOS
MPNOT6 SPIKES3 N049 VDD VDD PMOS
MNNOT6 SPIKES3 N049 N063 N063 NMOS
M5 VDD SPIKES3 VOUT3 VOUT3 NMOS
M6 VOUT3 Vint 0 0 NMOS
Cint3 VOUT3 0 0.1µ
MW4 N072 vw N070 N070 PMOS
Csyn4 N072 0 10n V=4 Irms=162m Rser=0.395426 Lser=0 mfg="KEMET" pn="C0402C103K7PAC" type="X5R" IC=0
Ck4 SPIKES4 0 10n
MPNOT7 N066 N072 VDD VDD PMOS
MNNOT7 N066 N072 0 0 NMOS
MVREF4 N074 VREF 0 0 NMOS
MREF4 N072 SPIKES4 0 0 NMOS
MVLK4 N072 v3 0 0 NMOS
MINA4 N072 N066 VDD VDD PMOS
MIN4 N070 VPOS VDD VDD PMOS
MPNOT8 SPIKES4 N066 VDD VDD PMOS
MNNOT8 SPIKES4 N066 N074 N074 NMOS
M7 VDD SPIKES4 VOUT4 VOUT4 NMOS
M8 VOUT4 Vint 0 0 NMOS
Cint4 VOUT4 0 0.1µ
MW5 N008 vw N006 N006 PMOS
Csyn5 N008 0 10n V=4 Irms=162m Rser=0.395426 Lser=0 mfg="KEMET" pn="C0402C103K7PAC" type="X5R" IC=0
Ck5 SPIKES5 0 10n
MPNOT9 N004 N008 VDD VDD PMOS
MNNOT9 N004 N008 0 0 NMOS
MVREF5 N017 VREF 0 0 NMOS
MREF5 N008 SPIKES5 0 0 NMOS
MVLK5 N008 v0 0 0 NMOS
MINA5 N008 N004 VDD VDD PMOS
MIN5 N006 VNEG VDD VDD PMOS
MPNOT10 SPIKES5 N004 VDD VDD PMOS
MNNOT10 SPIKES5 N004 N017 N017 NMOS
M9 VDD SPIKES5 VOUT5 VOUT5 NMOS
M10 VOUT5 Vint 0 0 NMOS
Cint5 VOUT5 0 0.1µ
MW6 N029 vw N027 N027 PMOS
Csyn6 N029 0 10n V=4 Irms=162m Rser=0.395426 Lser=0 mfg="KEMET" pn="C0402C103K7PAC" type="X5R" IC=0
Ck6 SPIKES6 0 10n
MPNOT11 N023 N029 VDD VDD PMOS
MNNOT11 N023 N029 0 0 NMOS
MVREF6 N031 VREF 0 0 NMOS
MREF6 N029 SPIKES6 0 0 NMOS
MVLK6 N029 v1 0 0 NMOS
MINA6 N029 N023 VDD VDD PMOS
MIN6 N027 VNEG VDD VDD PMOS
MPNOT12 SPIKES6 N023 VDD VDD PMOS
MNNOT12 SPIKES6 N023 N031 N031 NMOS
M11 VDD SPIKES6 VOUT6 VOUT6 NMOS
M12 VOUT6 Vint 0 0 NMOS
Cint6 VOUT6 0 0.1µ
MW7 N056 vw N052 N052 PMOS
Csyn7 N056 0 10n V=4 Irms=162m Rser=0.395426 Lser=0 mfg="KEMET" pn="C0402C103K7PAC" type="X5R" IC=0
Ck7 SPIKES7 0 10n
MPNOT13 N048 N056 VDD VDD PMOS
MNNOT13 N048 N056 0 0 NMOS
MVREF7 N059 VREF 0 0 NMOS
MREF7 N056 SPIKES7 0 0 NMOS
MVLK7 N056 v2 0 0 NMOS
MINA7 N056 N048 VDD VDD PMOS
MIN7 N052 VNEG VDD VDD PMOS
MPNOT14 SPIKES7 N048 VDD VDD PMOS
MNNOT14 SPIKES7 N048 N059 N059 NMOS
M13 VDD SPIKES7 VOUT7 VOUT7 NMOS
M14 VOUT7 Vint 0 0 NMOS
Cint7 VOUT7 0 0.1µ
MW8 N071 vw N069 N069 PMOS
Csyn8 N071 0 10n V=4 Irms=162m Rser=0.395426 Lser=0 mfg="KEMET" pn="C0402C103K7PAC" type="X5R" IC=0
Ck8 SPIKES8 0 10n
MPNOT15 N065 N071 VDD VDD PMOS
MNNOT15 N065 N071 0 0 NMOS
MVREF8 N073 VREF 0 0 NMOS
MREF8 N071 SPIKES8 0 0 NMOS
MVLK8 N071 v3 0 0 NMOS
MINA8 N071 N065 VDD VDD PMOS
MIN8 N069 VNEG VDD VDD PMOS
MPNOT16 SPIKES8 N065 VDD VDD PMOS
MNNOT16 SPIKES8 N065 N073 N073 NMOS
M15 VDD SPIKES8 VOUT8 VOUT8 NMOS
M16 VOUT8 Vint 0 0 NMOS
Cint8 VOUT8 0 0.1µ
MW9 N007 vw N002 N002 PMOS
MIN9 N002 VPOS2 VDD VDD PMOS
MW10 N030 vw N026 N026 PMOS
MIN10 N026 VPOS2 VDD VDD PMOS
MW11 N057 vw N051 N051 PMOS
MIN11 N051 VPOS2 VDD VDD PMOS
MW12 N072 vw N068 N068 PMOS
MIN12 N068 VPOS2 VDD VDD PMOS
MW13 N008 vw N005 N005 PMOS
MIN13 N005 VNEG2 VDD VDD PMOS
MW14 N029 vw N025 N025 PMOS
MIN14 N025 VNEG2 VDD VDD PMOS
MW15 N056 vw N050 N050 PMOS
MIN15 N050 VNEG2 VDD VDD PMOS
MW16 N071 vw N067 N067 PMOS
MIN16 N067 VNEG2 VDD VDD PMOS
XU135 N077 X1 VSS+ VSS- X1 LT1001  ; pins In+ In- V+ V- OUT
XU136 VGND N064 VSS+ VSS- N075 LT1001  ; pins In+ In- V+ V- OUT
R384 N075 N064 1k
XU137 VGND N076 VSS+ VSS- N077 LT1001  ; pins In+ In- V+ V- OUT
R385 N076 N077 1k
R386 N075 N076 1k
R387 N064 T12 1k
R388 N064 T22 1k
R389 N064 T32 1k
R390 N064 T42 1k
R391 N064 T52 1k
R392 N064 T62 1k
R393 N064 T72 1k
R394 N064 T82 1k
XU138 N083 N080 VSS+ VSS- N081 LT1001  ; pins In+ In- V+ V- OUT
R395 VGND N083 1k
R396 N083 N082 1k
R397 N080 N079 1k
R398 N081 N080 1k
XU139 N081 N084 VSS+ VSS- N084 LT1001  ; pins In+ In- V+ V- OUT
R399 X1 N078 20k
C10 N078 VGND 500n
XU140 N078 N079 VSS+ VSS- N079 LT1001  ; pins In+ In- V+ V- OUT
R400 N084 ERRORSIG2 7K
R401 ERRORSIG2 0 1K
M25 N215 Wc N190 N215 NMOS
C11 N215 VGND {C} IC=0
XU141 VGND N198 VSS+ VSS- N199 LT1001  ; pins In+ In- V+ V- OUT
R402 N199 N198 1k
R403 N198 N161 1k
R404 N198 N208 1k
XU142 VGND N189 VSS+ VSS- N190 LT1001  ; pins In+ In- V+ V- OUT
R405 N189 N190 1k
R406 N199 N189 1k
XU143 N215 N208 VSS+ VSS- N208 LT1001  ; pins In+ In- V+ V- OUT
XU144 N215 N129 VSS+ VSS- N129 LT1001  ; pins In+ In- V+ V- OUT
R407 N151 N187 {LRB}
R408 N187 VGND {LR}
XU145 ERRORSIG2 N188 VSS+ VSS- N188 LT1001  ; pins In+ In- V+ V- OUT
D129 N158 N153 RB511VM-40
XU146 VGND N152 VSS+ VSS- N153 LT1001  ; pins In+ In- V+ V- OUT
R409 N152 N153 1k
R410 N103 N152 1k
D130 N158 N188 RB511VM-40
D131 N153 N206 RB511VM-40
D132 N188 N206 RB511VM-40
R411 VDD N158 500k
R412 N206 VGND 50k
D133 N146 N188 RB511VM-40
D134 N146 N103 RB511VM-40
D135 N188 N207 RB511VM-40
D136 N103 N207 RB511VM-40
R413 VDD N146 500k
R414 N207 VGND 50k
XU147 N147 N159 VSS+ VSS- N162 LT1001  ; pins In+ In- V+ V- OUT
R415 N159 N162 1k
R416 VGND N147 1k
R417 N159 N158 5k
R418 N159 N207 5k
R419 N147 N146 5k
R420 N147 N206 5k
R421 N206 N158 1k
R422 N207 N146 1k
R423 N162 N200 150
XU148 N200 N160 VSS+ VSS- N161 LT1001  ; pins In+ In- V+ V- OUT
R424 N160 N161 680
R425 VGND N160 330
XU149 N187 N103 VSS+ VSS- N103 LT1001  ; pins In+ In- V+ V- OUT
XU150 N209 T12 VSS+ VSS- T12 LT1001  ; pins In+ In- V+ V- OUT
D137 N172 N164 RB511VM-40
XU151 VGND N163 VSS+ VSS- N164 LT1001  ; pins In+ In- V+ V- OUT
R426 N163 N164 1k
R427 N129 N163 1k
D138 N172 N151 RB511VM-40
D139 N164 N219 RB511VM-40
D140 N151 N219 RB511VM-40
R428 VDD N172 500k
R429 N219 VGND 50k
D141 N165 N151 RB511VM-40
D142 N165 N129 RB511VM-40
D143 N151 N220 RB511VM-40
D144 N129 N220 RB511VM-40
R430 VDD N165 500k
R431 N220 VGND 50k
XU152 N166 N173 VSS+ VSS- N177 LT1001  ; pins In+ In- V+ V- OUT
R432 N173 N177 1k
R433 VGND N166 1k
R434 N173 N172 5k
R435 N173 N220 5k
R436 N166 N165 5k
R437 N166 N219 5k
R438 N219 N172 1k
R439 N220 N165 1k
R440 N177 N210 150
XU153 N210 N178 VSS+ VSS- N179 LT1001  ; pins In+ In- V+ V- OUT
R441 N178 N179 680
R442 N179 N209 150
R443 VGND N178 330
XU154 VOUT1 N151 VSS+ VSS- N151 LT1001  ; pins In+ In- V+ V- OUT
M26 N359 Wc N334 N359 NMOS
C12 N359 VGND {C} IC=0
XU155 VGND N342 VSS+ VSS- N343 LT1001  ; pins In+ In- V+ V- OUT
R444 N343 N342 1k
R445 N342 N305 1k
R446 N342 N352 1k
XU156 VGND N333 VSS+ VSS- N334 LT1001  ; pins In+ In- V+ V- OUT
R447 N333 N334 1k
R448 N343 N333 1k
XU157 N359 N352 VSS+ VSS- N352 LT1001  ; pins In+ In- V+ V- OUT
XU158 N359 N273 VSS+ VSS- N273 LT1001  ; pins In+ In- V+ V- OUT
R449 N295 N331 {LRB}
R450 N331 VGND {LR}
XU159 ERRORSIG2 N332 VSS+ VSS- N332 LT1001  ; pins In+ In- V+ V- OUT
D145 N302 N297 RB511VM-40
XU160 VGND N296 VSS+ VSS- N297 LT1001  ; pins In+ In- V+ V- OUT
R451 N296 N297 1k
R452 N247 N296 1k
D146 N302 N332 RB511VM-40
D147 N297 N350 RB511VM-40
D148 N332 N350 RB511VM-40
R453 VDD N302 500k
R454 N350 VGND 50k
D149 N290 N332 RB511VM-40
D150 N290 N247 RB511VM-40
D151 N332 N351 RB511VM-40
D152 N247 N351 RB511VM-40
R455 VDD N290 500k
R456 N351 VGND 50k
XU161 N291 N303 VSS+ VSS- N306 LT1001  ; pins In+ In- V+ V- OUT
R457 N303 N306 1k
R458 VGND N291 1k
R459 N303 N302 5k
R460 N303 N351 5k
R461 N291 N290 5k
R462 N291 N350 5k
R463 N350 N302 1k
R464 N351 N290 1k
R465 N306 N344 150
XU162 N344 N304 VSS+ VSS- N305 LT1001  ; pins In+ In- V+ V- OUT
R466 N304 N305 680
R467 VGND N304 330
XU163 N331 N247 VSS+ VSS- N247 LT1001  ; pins In+ In- V+ V- OUT
XU164 N353 T22 VSS+ VSS- T22 LT1001  ; pins In+ In- V+ V- OUT
D153 N316 N308 RB511VM-40
XU165 VGND N307 VSS+ VSS- N308 LT1001  ; pins In+ In- V+ V- OUT
R468 N307 N308 1k
R469 N273 N307 1k
D154 N316 N295 RB511VM-40
D155 N308 N363 RB511VM-40
D156 N295 N363 RB511VM-40
R470 VDD N316 500k
R471 N363 VGND 50k
D157 N309 N295 RB511VM-40
D158 N309 N273 RB511VM-40
D159 N295 N364 RB511VM-40
D160 N273 N364 RB511VM-40
R472 VDD N309 500k
R473 N364 VGND 50k
XU166 N310 N317 VSS+ VSS- N321 LT1001  ; pins In+ In- V+ V- OUT
R474 N317 N321 1k
R475 VGND N310 1k
R476 N317 N316 5k
R477 N317 N364 5k
R478 N310 N309 5k
R479 N310 N363 5k
R480 N363 N316 1k
R481 N364 N309 1k
R482 N321 N354 150
XU167 N354 N322 VSS+ VSS- N323 LT1001  ; pins In+ In- V+ V- OUT
R483 N322 N323 680
R484 N323 N353 150
R485 VGND N322 330
XU168 VOUT2 N295 VSS+ VSS- N295 LT1001  ; pins In+ In- V+ V- OUT
M27 N503 Wc N478 N503 NMOS
C13 N503 VGND {C} IC=0
XU169 VGND N486 VSS+ VSS- N487 LT1001  ; pins In+ In- V+ V- OUT
R486 N487 N486 1k
R487 N486 N449 1k
R488 N486 N496 1k
XU170 VGND N477 VSS+ VSS- N478 LT1001  ; pins In+ In- V+ V- OUT
R489 N477 N478 1k
R490 N487 N477 1k
XU171 N503 N496 VSS+ VSS- N496 LT1001  ; pins In+ In- V+ V- OUT
XU172 N503 N417 VSS+ VSS- N417 LT1001  ; pins In+ In- V+ V- OUT
R491 N439 N475 {LRB}
R492 N475 VGND {LR}
XU173 ERRORSIG2 N476 VSS+ VSS- N476 LT1001  ; pins In+ In- V+ V- OUT
D161 N446 N441 RB511VM-40
XU174 VGND N440 VSS+ VSS- N441 LT1001  ; pins In+ In- V+ V- OUT
R493 N440 N441 1k
R494 N391 N440 1k
D162 N446 N476 RB511VM-40
D163 N441 N494 RB511VM-40
D164 N476 N494 RB511VM-40
R495 VDD N446 500k
R496 N494 VGND 50k
D165 N434 N476 RB511VM-40
D166 N434 N391 RB511VM-40
D167 N476 N495 RB511VM-40
D168 N391 N495 RB511VM-40
R497 VDD N434 500k
R498 N495 VGND 50k
XU175 N435 N447 VSS+ VSS- N450 LT1001  ; pins In+ In- V+ V- OUT
R499 N447 N450 1k
R500 VGND N435 1k
R501 N447 N446 5k
R502 N447 N495 5k
R503 N435 N434 5k
R504 N435 N494 5k
R505 N494 N446 1k
R506 N495 N434 1k
R507 N450 N488 150
XU176 N488 N448 VSS+ VSS- N449 LT1001  ; pins In+ In- V+ V- OUT
R508 N448 N449 680
R509 VGND N448 330
XU177 N475 N391 VSS+ VSS- N391 LT1001  ; pins In+ In- V+ V- OUT
XU178 N497 T32 VSS+ VSS- T32 LT1001  ; pins In+ In- V+ V- OUT
D169 N460 N452 RB511VM-40
XU179 VGND N451 VSS+ VSS- N452 LT1001  ; pins In+ In- V+ V- OUT
R510 N451 N452 1k
R511 N417 N451 1k
D170 N460 N439 RB511VM-40
D171 N452 N507 RB511VM-40
D172 N439 N507 RB511VM-40
R512 VDD N460 500k
R513 N507 VGND 50k
D173 N453 N439 RB511VM-40
D174 N453 N417 RB511VM-40
D175 N439 N508 RB511VM-40
D176 N417 N508 RB511VM-40
R514 VDD N453 500k
R515 N508 VGND 50k
XU180 N454 N461 VSS+ VSS- N465 LT1001  ; pins In+ In- V+ V- OUT
R516 N461 N465 1k
R517 VGND N454 1k
R518 N461 N460 5k
R519 N461 N508 5k
R520 N454 N453 5k
R521 N454 N507 5k
R522 N507 N460 1k
R523 N508 N453 1k
R524 N465 N498 150
XU181 N498 N466 VSS+ VSS- N467 LT1001  ; pins In+ In- V+ V- OUT
R525 N466 N467 680
R526 N467 N497 150
R527 VGND N466 330
XU182 VOUT3 N439 VSS+ VSS- N439 LT1001  ; pins In+ In- V+ V- OUT
M28 N647 Wc N622 N647 NMOS
C14 N647 VGND {C} IC=0
XU183 VGND N630 VSS+ VSS- N631 LT1001  ; pins In+ In- V+ V- OUT
R528 N631 N630 1k
R529 N630 N593 1k
R530 N630 N640 1k
XU184 VGND N621 VSS+ VSS- N622 LT1001  ; pins In+ In- V+ V- OUT
R531 N621 N622 1k
R532 N631 N621 1k
XU185 N647 N640 VSS+ VSS- N640 LT1001  ; pins In+ In- V+ V- OUT
XU186 N647 N561 VSS+ VSS- N561 LT1001  ; pins In+ In- V+ V- OUT
R533 N583 N619 {LRB}
R534 N619 VGND {LR}
XU187 ERRORSIG2 N620 VSS+ VSS- N620 LT1001  ; pins In+ In- V+ V- OUT
D177 N590 N585 RB511VM-40
XU188 VGND N584 VSS+ VSS- N585 LT1001  ; pins In+ In- V+ V- OUT
R535 N584 N585 1k
R536 N535 N584 1k
D178 N590 N620 RB511VM-40
D179 N585 N638 RB511VM-40
D180 N620 N638 RB511VM-40
R537 VDD N590 500k
R538 N638 VGND 50k
D181 N578 N620 RB511VM-40
D182 N578 N535 RB511VM-40
D183 N620 N639 RB511VM-40
D184 N535 N639 RB511VM-40
R539 VDD N578 500k
R540 N639 VGND 50k
XU189 N579 N591 VSS+ VSS- N594 LT1001  ; pins In+ In- V+ V- OUT
R541 N591 N594 1k
R542 VGND N579 1k
R543 N591 N590 5k
R544 N591 N639 5k
R545 N579 N578 5k
R546 N579 N638 5k
R547 N638 N590 1k
R548 N639 N578 1k
R549 N594 N632 150
XU190 N632 N592 VSS+ VSS- N593 LT1001  ; pins In+ In- V+ V- OUT
R550 N592 N593 680
R551 VGND N592 330
XU191 N619 N535 VSS+ VSS- N535 LT1001  ; pins In+ In- V+ V- OUT
XU192 N641 T42 VSS+ VSS- T42 LT1001  ; pins In+ In- V+ V- OUT
D185 N604 N596 RB511VM-40
XU193 VGND N595 VSS+ VSS- N596 LT1001  ; pins In+ In- V+ V- OUT
R552 N595 N596 1k
R553 N561 N595 1k
D186 N604 N583 RB511VM-40
D187 N596 N651 RB511VM-40
D188 N583 N651 RB511VM-40
R554 VDD N604 500k
R555 N651 VGND 50k
D189 N597 N583 RB511VM-40
D190 N597 N561 RB511VM-40
D191 N583 N652 RB511VM-40
D192 N561 N652 RB511VM-40
R556 VDD N597 500k
R557 N652 VGND 50k
XU194 N598 N605 VSS+ VSS- N609 LT1001  ; pins In+ In- V+ V- OUT
R558 N605 N609 1k
R559 VGND N598 1k
R560 N605 N604 5k
R561 N605 N652 5k
R562 N598 N597 5k
R563 N598 N651 5k
R564 N651 N604 1k
R565 N652 N597 1k
R566 N609 N642 150
XU195 N642 N610 VSS+ VSS- N611 LT1001  ; pins In+ In- V+ V- OUT
R567 N610 N611 680
R568 N611 N641 150
R569 VGND N610 330
XU196 VOUT4 N583 VSS+ VSS- N583 LT1001  ; pins In+ In- V+ V- OUT
M29 N226 Wc N214 N226 NMOS
C15 N226 VGND {C} IC=0
XU197 VGND N216 VSS+ VSS- N217 LT1001  ; pins In+ In- V+ V- OUT
R570 N217 N216 1k
R571 N216 N192 1k
R572 N216 N223 1k
XU198 VGND N213 VSS+ VSS- N214 LT1001  ; pins In+ In- V+ V- OUT
R573 N213 N214 1k
R574 N217 N213 1k
XU199 N226 N223 VSS+ VSS- N223 LT1001  ; pins In+ In- V+ V- OUT
XU200 N226 N154 VSS+ VSS- N154 LT1001  ; pins In+ In- V+ V- OUT
R575 N180 N211 {LRB}
R576 N211 VGND {LR}
XU201 ERRORSIG2 N212 VSS+ VSS- N212 LT1001  ; pins In+ In- V+ V- OUT
D193 N185 N182 RB511VM-40
XU202 VGND N181 VSS+ VSS- N182 LT1001  ; pins In+ In- V+ V- OUT
R577 N181 N182 1k
R578 N131 N181 1k
D194 N185 N212 RB511VM-40
D195 N182 N221 RB511VM-40
D196 N212 N221 RB511VM-40
R579 VDD N185 500k
R580 N221 VGND 50k
D197 N174 N212 RB511VM-40
D198 N174 N131 RB511VM-40
D199 N212 N222 RB511VM-40
D200 N131 N222 RB511VM-40
R581 VDD N174 500k
R582 N222 VGND 50k
XU203 N175 N186 VSS+ VSS- N193 LT1001  ; pins In+ In- V+ V- OUT
R583 N186 N193 1k
R584 VGND N175 1k
R585 N186 N185 5k
R586 N186 N222 5k
R587 N175 N174 5k
R588 N175 N221 5k
R589 N221 N185 1k
R590 N222 N174 1k
R591 N193 N218 150
XU204 N218 N191 VSS+ VSS- N192 LT1001  ; pins In+ In- V+ V- OUT
R592 N191 N192 680
R593 VGND N191 330
XU205 N211 N131 VSS+ VSS- N131 LT1001  ; pins In+ In- V+ V- OUT
XU206 N224 T52 VSS+ VSS- T52 LT1001  ; pins In+ In- V+ V- OUT
D201 N201 N195 RB511VM-40
XU207 VGND N194 VSS+ VSS- N195 LT1001  ; pins In+ In- V+ V- OUT
R594 N194 N195 1k
R595 N154 N194 1k
D202 N201 N180 RB511VM-40
D203 N195 N227 RB511VM-40
D204 N180 N227 RB511VM-40
R596 VDD N201 500k
R597 N227 VGND 50k
D205 N196 N180 RB511VM-40
D206 N196 N154 RB511VM-40
D207 N180 N228 RB511VM-40
D208 N154 N228 RB511VM-40
R598 VDD N196 500k
R599 N228 VGND 50k
XU208 N197 N202 VSS+ VSS- N203 LT1001  ; pins In+ In- V+ V- OUT
R600 N202 N203 1k
R601 VGND N197 1k
R602 N202 N201 5k
R603 N202 N228 5k
R604 N197 N196 5k
R605 N197 N227 5k
R606 N227 N201 1k
R607 N228 N196 1k
R608 N203 N225 150
XU209 N225 N204 VSS+ VSS- N205 LT1001  ; pins In+ In- V+ V- OUT
R609 N204 N205 680
R610 N205 N224 150
R611 VGND N204 330
XU210 VOUT5 N180 VSS+ VSS- N180 LT1001  ; pins In+ In- V+ V- OUT
M30 N370 Wc N358 N370 NMOS
C16 N370 VGND {C} IC=0
XU211 VGND N360 VSS+ VSS- N361 LT1001  ; pins In+ In- V+ V- OUT
R612 N361 N360 1k
R613 N360 N336 1k
R614 N360 N367 1k
XU212 VGND N357 VSS+ VSS- N358 LT1001  ; pins In+ In- V+ V- OUT
R615 N357 N358 1k
R616 N361 N357 1k
XU213 N370 N367 VSS+ VSS- N367 LT1001  ; pins In+ In- V+ V- OUT
XU214 N370 N298 VSS+ VSS- N298 LT1001  ; pins In+ In- V+ V- OUT
R617 N324 N355 {LRB}
R618 N355 VGND {LR}
XU215 ERRORSIG2 N356 VSS+ VSS- N356 LT1001  ; pins In+ In- V+ V- OUT
D209 N329 N326 RB511VM-40
XU216 VGND N325 VSS+ VSS- N326 LT1001  ; pins In+ In- V+ V- OUT
R619 N325 N326 1k
R620 N275 N325 1k
D210 N329 N356 RB511VM-40
D211 N326 N365 RB511VM-40
D212 N356 N365 RB511VM-40
R621 VDD N329 500k
R622 N365 VGND 50k
D213 N318 N356 RB511VM-40
D214 N318 N275 RB511VM-40
D215 N356 N366 RB511VM-40
D216 N275 N366 RB511VM-40
R623 VDD N318 500k
R624 N366 VGND 50k
XU217 N319 N330 VSS+ VSS- N337 LT1001  ; pins In+ In- V+ V- OUT
R625 N330 N337 1k
R626 VGND N319 1k
R627 N330 N329 5k
R628 N330 N366 5k
R629 N319 N318 5k
R630 N319 N365 5k
R631 N365 N329 1k
R632 N366 N318 1k
R633 N337 N362 150
XU218 N362 N335 VSS+ VSS- N336 LT1001  ; pins In+ In- V+ V- OUT
R634 N335 N336 680
R635 VGND N335 330
XU219 N355 N275 VSS+ VSS- N275 LT1001  ; pins In+ In- V+ V- OUT
XU220 N368 T62 VSS+ VSS- T62 LT1001  ; pins In+ In- V+ V- OUT
D217 N345 N339 RB511VM-40
XU221 VGND N338 VSS+ VSS- N339 LT1001  ; pins In+ In- V+ V- OUT
R636 N338 N339 1k
R637 N298 N338 1k
D218 N345 N324 RB511VM-40
D219 N339 N371 RB511VM-40
D220 N324 N371 RB511VM-40
R638 VDD N345 500k
R639 N371 VGND 50k
D221 N340 N324 RB511VM-40
D222 N340 N298 RB511VM-40
D223 N324 N372 RB511VM-40
D224 N298 N372 RB511VM-40
R640 VDD N340 500k
R641 N372 VGND 50k
XU222 N341 N346 VSS+ VSS- N347 LT1001  ; pins In+ In- V+ V- OUT
R642 N346 N347 1k
R643 VGND N341 1k
R644 N346 N345 5k
R645 N346 N372 5k
R646 N341 N340 5k
R647 N341 N371 5k
R648 N371 N345 1k
R649 N372 N340 1k
R650 N347 N369 150
XU223 N369 N348 VSS+ VSS- N349 LT1001  ; pins In+ In- V+ V- OUT
R651 N348 N349 680
R652 N349 N368 150
R653 VGND N348 330
XU224 VOUT6 N324 VSS+ VSS- N324 LT1001  ; pins In+ In- V+ V- OUT
M31 N514 Wc N502 N514 NMOS
C17 N514 VGND {C} IC=0
XU225 VGND N504 VSS+ VSS- N505 LT1001  ; pins In+ In- V+ V- OUT
R654 N505 N504 1k
R655 N504 N480 1k
R656 N504 N511 1k
XU226 VGND N501 VSS+ VSS- N502 LT1001  ; pins In+ In- V+ V- OUT
R657 N501 N502 1k
R658 N505 N501 1k
XU227 N514 N511 VSS+ VSS- N511 LT1001  ; pins In+ In- V+ V- OUT
XU228 N514 N442 VSS+ VSS- N442 LT1001  ; pins In+ In- V+ V- OUT
R659 N468 N499 {LRB}
R660 N499 VGND {LR}
XU229 ERRORSIG2 N500 VSS+ VSS- N500 LT1001  ; pins In+ In- V+ V- OUT
D225 N473 N470 RB511VM-40
XU230 VGND N469 VSS+ VSS- N470 LT1001  ; pins In+ In- V+ V- OUT
R661 N469 N470 1k
R662 N419 N469 1k
D226 N473 N500 RB511VM-40
D227 N470 N509 RB511VM-40
D228 N500 N509 RB511VM-40
R663 VDD N473 500k
R664 N509 VGND 50k
D229 N462 N500 RB511VM-40
D230 N462 N419 RB511VM-40
D231 N500 N510 RB511VM-40
D232 N419 N510 RB511VM-40
R665 VDD N462 500k
R666 N510 VGND 50k
XU231 N463 N474 VSS+ VSS- N481 LT1001  ; pins In+ In- V+ V- OUT
R667 N474 N481 1k
R668 VGND N463 1k
R669 N474 N473 5k
R670 N474 N510 5k
R671 N463 N462 5k
R672 N463 N509 5k
R673 N509 N473 1k
R674 N510 N462 1k
R675 N481 N506 150
XU232 N506 N479 VSS+ VSS- N480 LT1001  ; pins In+ In- V+ V- OUT
R676 N479 N480 680
R677 VGND N479 330
XU233 N499 N419 VSS+ VSS- N419 LT1001  ; pins In+ In- V+ V- OUT
XU234 N512 T72 VSS+ VSS- T72 LT1001  ; pins In+ In- V+ V- OUT
D233 N489 N483 RB511VM-40
XU235 VGND N482 VSS+ VSS- N483 LT1001  ; pins In+ In- V+ V- OUT
R678 N482 N483 1k
R679 N442 N482 1k
D234 N489 N468 RB511VM-40
D235 N483 N515 RB511VM-40
D236 N468 N515 RB511VM-40
R680 VDD N489 500k
R681 N515 VGND 50k
D237 N484 N468 RB511VM-40
D238 N484 N442 RB511VM-40
D239 N468 N516 RB511VM-40
D240 N442 N516 RB511VM-40
R682 VDD N484 500k
R683 N516 VGND 50k
XU236 N485 N490 VSS+ VSS- N491 LT1001  ; pins In+ In- V+ V- OUT
R684 N490 N491 1k
R685 VGND N485 1k
R686 N490 N489 5k
R687 N490 N516 5k
R688 N485 N484 5k
R689 N485 N515 5k
R690 N515 N489 1k
R691 N516 N484 1k
R692 N491 N513 150
XU237 N513 N492 VSS+ VSS- N493 LT1001  ; pins In+ In- V+ V- OUT
R693 N492 N493 680
R694 N493 N512 150
R695 VGND N492 330
XU238 VOUT7 N468 VSS+ VSS- N468 LT1001  ; pins In+ In- V+ V- OUT
M32 N658 Wc N646 N658 NMOS
C18 N658 VGND {C} IC=0
XU239 VGND N648 VSS+ VSS- N649 LT1001  ; pins In+ In- V+ V- OUT
R696 N649 N648 1k
R697 N648 N624 1k
R698 N648 N655 1k
XU240 VGND N645 VSS+ VSS- N646 LT1001  ; pins In+ In- V+ V- OUT
R699 N645 N646 1k
R700 N649 N645 1k
XU241 N658 N655 VSS+ VSS- N655 LT1001  ; pins In+ In- V+ V- OUT
XU242 N658 N586 VSS+ VSS- N586 LT1001  ; pins In+ In- V+ V- OUT
R701 N612 N643 {LRB}
R702 N643 VGND {LR}
XU243 ERRORSIG2 N644 VSS+ VSS- N644 LT1001  ; pins In+ In- V+ V- OUT
D241 N617 N614 RB511VM-40
XU244 VGND N613 VSS+ VSS- N614 LT1001  ; pins In+ In- V+ V- OUT
R703 N613 N614 1k
R704 N563 N613 1k
D242 N617 N644 RB511VM-40
D243 N614 N653 RB511VM-40
D244 N644 N653 RB511VM-40
R705 VDD N617 500k
R706 N653 VGND 50k
D245 N606 N644 RB511VM-40
D246 N606 N563 RB511VM-40
D247 N644 N654 RB511VM-40
D248 N563 N654 RB511VM-40
R707 VDD N606 500k
R708 N654 VGND 50k
XU245 N607 N618 VSS+ VSS- N625 LT1001  ; pins In+ In- V+ V- OUT
R709 N618 N625 1k
R710 VGND N607 1k
R711 N618 N617 5k
R712 N618 N654 5k
R713 N607 N606 5k
R714 N607 N653 5k
R715 N653 N617 1k
R716 N654 N606 1k
R717 N625 N650 150
XU246 N650 N623 VSS+ VSS- N624 LT1001  ; pins In+ In- V+ V- OUT
R718 N623 N624 680
R719 VGND N623 330
XU247 N643 N563 VSS+ VSS- N563 LT1001  ; pins In+ In- V+ V- OUT
XU248 N656 T82 VSS+ VSS- T82 LT1001  ; pins In+ In- V+ V- OUT
D249 N633 N627 RB511VM-40
XU249 VGND N626 VSS+ VSS- N627 LT1001  ; pins In+ In- V+ V- OUT
R720 N626 N627 1k
R721 N586 N626 1k
D250 N633 N612 RB511VM-40
D251 N627 N659 RB511VM-40
D252 N612 N659 RB511VM-40
R722 VDD N633 500k
R723 N659 VGND 50k
D253 N628 N612 RB511VM-40
D254 N628 N586 RB511VM-40
D255 N612 N660 RB511VM-40
D256 N586 N660 RB511VM-40
R724 VDD N628 500k
R725 N660 VGND 50k
XU250 N629 N634 VSS+ VSS- N635 LT1001  ; pins In+ In- V+ V- OUT
R726 N634 N635 1k
R727 VGND N629 1k
R728 N634 N633 5k
R729 N634 N660 5k
R730 N629 N628 5k
R731 N629 N659 5k
R732 N659 N633 1k
R733 N660 N628 1k
R734 N635 N657 150
XU251 N657 N636 VSS+ VSS- N637 LT1001  ; pins In+ In- V+ V- OUT
R735 N636 N637 680
R736 N637 N656 150
R737 VGND N636 330
XU252 VOUT8 N612 VSS+ VSS- N612 LT1001  ; pins In+ In- V+ V- OUT
V6 PIN 0 PULSE(0 100m 0 1p 1p 100m 6 1)
V7 PIN2 0 PULSE(0 800m 6 1p 1p 100m 6 1)
B1 X00 0 V= v(x0) + v(pin) + v(pin2)
B2 N060 0 V=v(x00) + 0.5*v(x1)
B3 N082 0 V=v(x1) -0.5*v(x0)
.model D D
.lib standard.dio
.model NMOS NMOS
.model PMOS PMOS
.lib standard.mos
.tran 12
.option noopiter
.param LR=1k
.param LRB=9K
.param c=1u
.lib LTC.lib
.backanno
.end